# EAGLE design mapleCUx_large_400-003 (EAGLE 9.3.0)
MAPLE-CUx Large Version
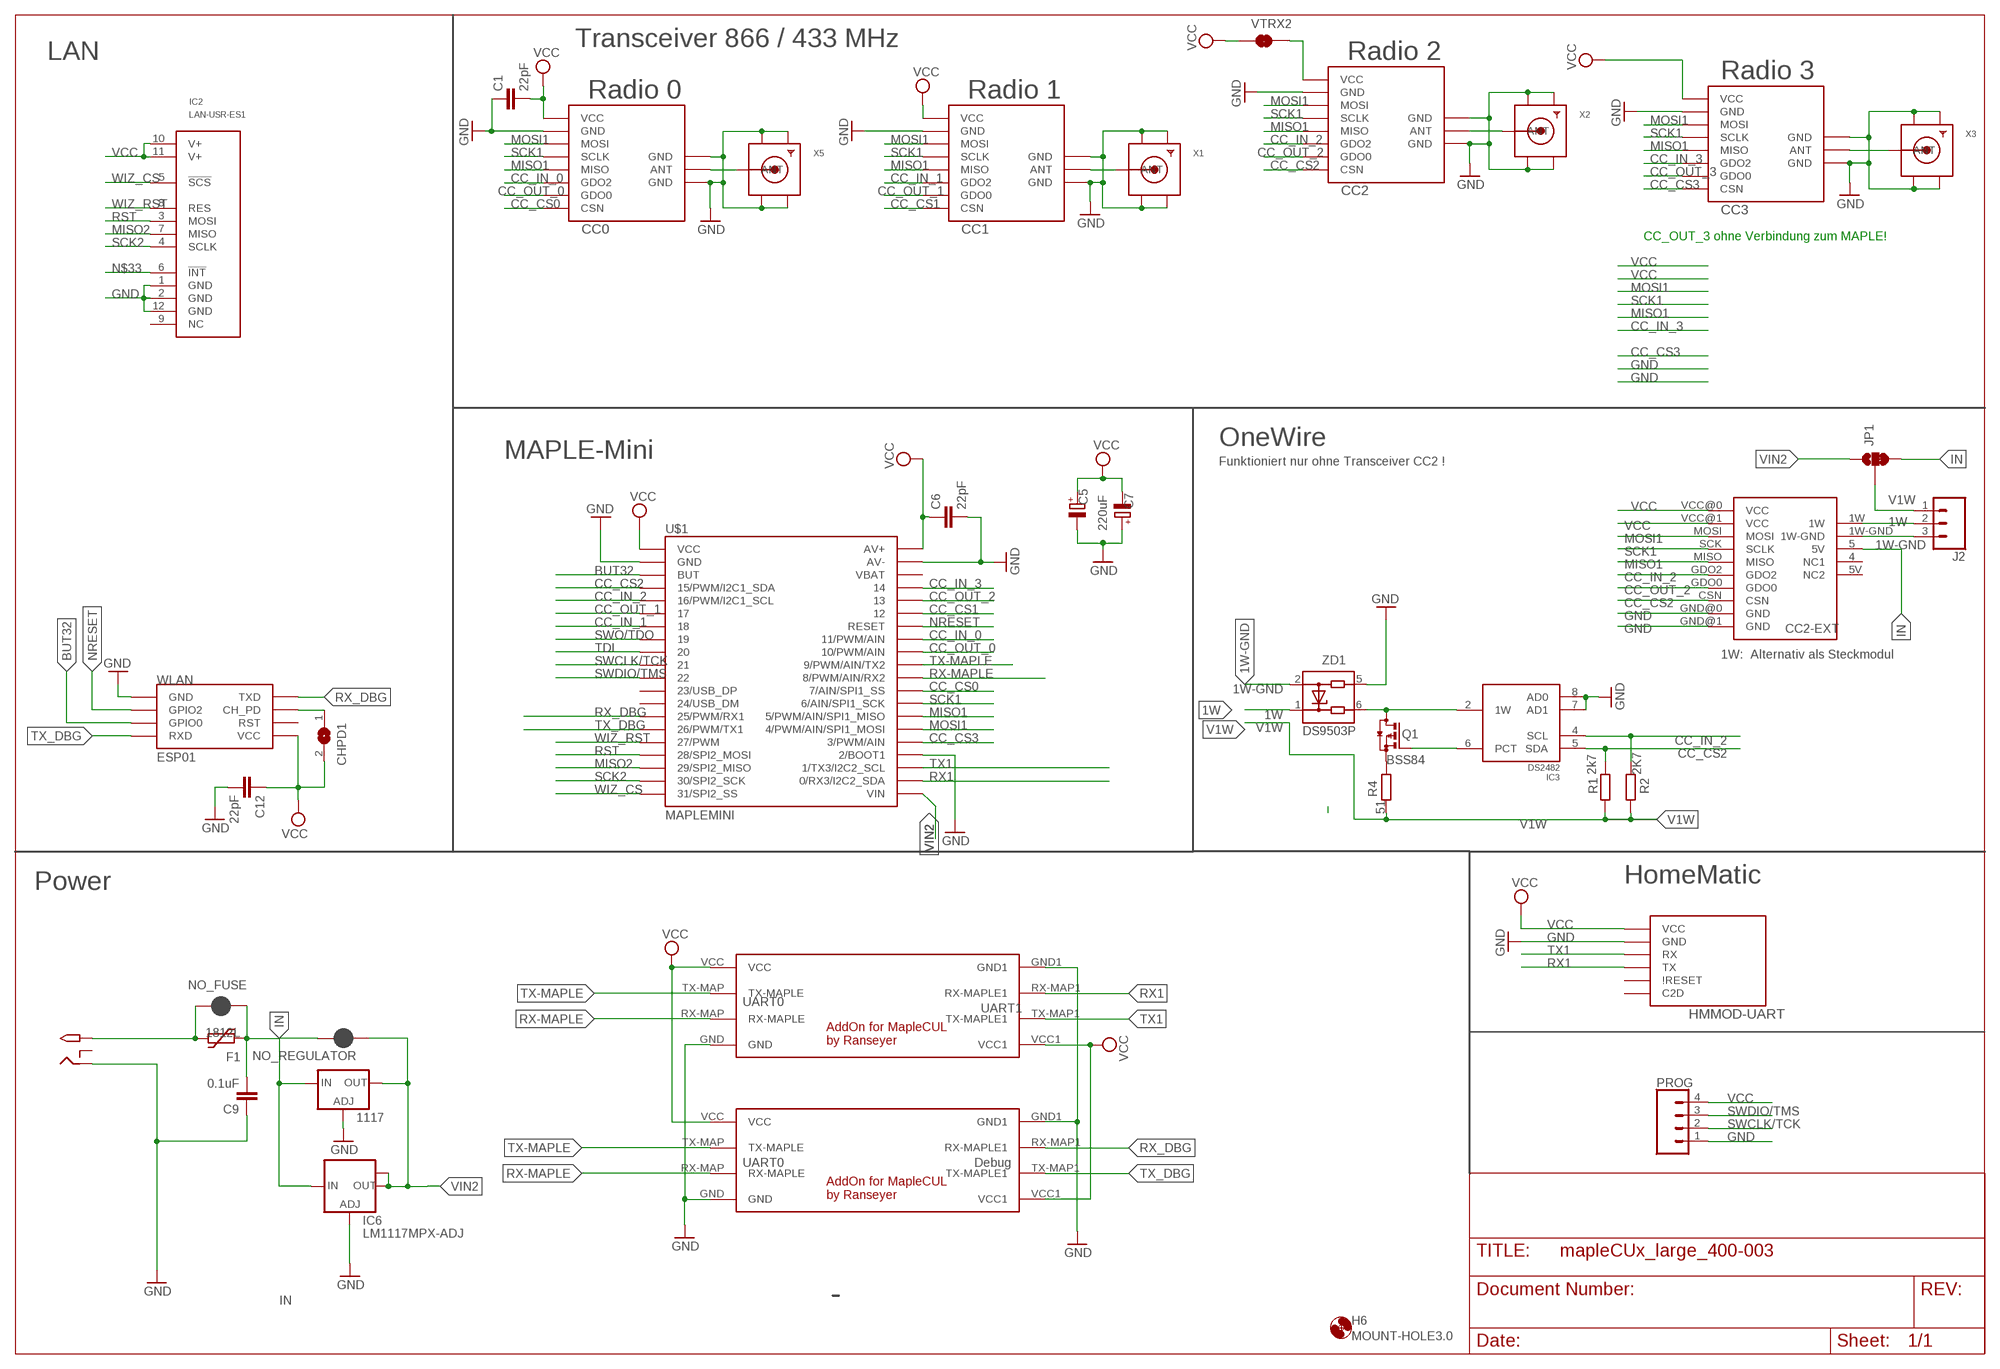
[diagram p0: schematic, sheet 1]

## Parts
1117  LD117ADT50TR  [DPACK]
C1  22pF  C-EUC0805  [C0805]
C5  220uF  CPOL-EUE5-8.5  [E5-8,5]
C6  22pF  C-EUC0805  [C0805]
C7  CPOL-EUSMCE  [SMC_E]
C9  0.1uF  C-EUC1206  [C1206]
C12  22pF  C-EUC0805  [C0805]
CC0  CC1101  CC1101_MODULE1SMD  [CC1101_MODULE1_SMD]
CC1  CC1101_MODULE1SMD  [CC1101_MODULE1_SMD]
CC2  CC1101_MODULE1SMD  [CC1101_MODULE1_SMD]
CC2-EXT  ONEWIRE-MODULE  [ONEWIRE_CC1101_MODULE3_DIL]
CC3  CC1101_MODULE1SMD  [CC1101_MODULE1_SMD]
CHPD1  SJ  [SJ]
F1  1812L  [1812L]
H6  MOUNT-HOLE3.0  [3,0]
HMMOD-UART  HM-MOD-UARTDIL  [HM-MOD-UART-DIL]
IC2  LAN-USR-ES1  [USR-ES1]
IC3  DS2482  DS2482-100S  [SO08]
IC6  LM1117MPX-ADJ  [SOT223]
J2  CONN_03LONGPADS  [1X03_LONGPADS]
JP1  JUMPER-SMT_3_1-NC_TRACE_SILK  [SMT-JUMPER_3_1-NC_TRACE_SILK]
NO_FUSE  JUMPER-SMT_2_NC_PASTE_NO-SILK  [SMT-JUMPER_2_NC_PASTE_NO-SILK]
NO_REGULATOR  JUMPER-SMT_2_NC_PASTE_NO-SILK  [SMT-JUMPER_2_NC_PASTE_NO-SILK]
PROG  CONN_04LOCK  [1X04_LOCK]
Q1  BSS84  [SOT23]
R1  2k7  R-EU_R0805  [R0805]
R2  2K7  R-EU_R0805  [R0805]
R4  51  R-EU_R0805  [R0805]
U$1  MAPLEMINI  [20-DIP]
U$2  2.1MMJACKTHM  [PJ-102A]
U$3  MAPLE-CUL-ADDON-V01  [MAPLE-CUL-V01]
U$4  MAPLE-CUL-ADDON-V01  [MAPLE-CUL-V01]
VTRX2  JUMPER-SMT_2_NC_TRACE_SILK  [SMT-JUMPER_2_NC_TRACE_SILK]
WLAN  ESP01  [ESP01]
X1  SMACONNECTOR_EDGE  [SMA_EDGELAUNCH]
X2  SMACONNECTOR_EDGE  [SMA_EDGELAUNCH]
X3  SMACONNECTOR_EDGE  [SMA_EDGELAUNCH]
X5  SMACONNECTOR_EDGE  [SMA_EDGELAUNCH]
ZD1  DS9503P  [TSOC6]

## Nets
1W: CC2-EXT.1W J2.2 ZD1.1
1W-GND: CC2-EXT.1W-GND J2.3 ZD1.2
ANT0: CC0.ANT X5.P(ANT)
ANT1: CC1.ANT X1.P(ANT)
ANT2: CC2.ANT X2.P(ANT)
ANT3: CC3.ANT X3.P(ANT)
BUT32: U$1.3(BUT) WLAN.GPIO0
CC_CS0: CC0.CSN U$1.29(7/AIN/SPI1_SS)
CC_CS1: CC1.CSN U$1.35
CC_CS2: CC2-EXT.CSN CC2.CSN IC3.5(SDA) R1.2 U$1.4(15/PWM/I2C1_SDA)
CC_CS3: CC3.CSN U$1.25(3/PWM/AIN)
CC_IN_0: CC0.GDO2 U$1.33(11/PWM/AIN)
CC_IN_1: CC1.GDO2 U$1.7
CC_IN_2: CC2-EXT.GDO2 CC2.GDO2 IC3.4(SCL) R2.2 U$1.5(16/PWM/I2C1_SCL)
CC_IN_3: CC3.GDO2 U$1.37
CC_OUT_0: CC0.GDO0 U$1.32(10/PWM/AIN)
CC_OUT_1: CC1.GDO0 U$1.6
CC_OUT_2: CC2-EXT.GDO0 CC2.GDO0 U$1.36
CC_OUT_3: CC3.GDO0
GND [Power]: 1117.1(ADJ) C1.1 C5.- C6.2 C7.+ C9.1 C12.2 CC0.GND@0(GND) CC0.GND@1(GND) CC0.GND@2(GND) CC1.GND@0(GND) CC1.GND@1(GND) CC1.GND@2(GND) CC2-EXT.GND@0(GND) CC2-EXT.GND@1(GND) CC2.GND@0(GND) CC2.GND@1(GND) CC2.GND@2(GND) CC3.GND@0(GND) CC3.GND@1(GND) CC3.GND@2(GND) HMMOD-UART.2(GND) IC2.1(GND) IC2.2(GND) IC2.12(GND) IC3.7(AD1) IC3.8(AD0) IC6.1(ADJ) PROG.1 U$1.2(GND) U$1.24(2/BOOT1) U$1.39(AV-) U$2.RING U$3.GND U$3.GND1 U$4.GND U$4.GND1 WLAN.GND X1.GND@1(GND4) X1.GND@2(GND3) X1.GND@3(GND2) X1.GND@4(GND1) X2.GND@1(GND4) X2.GND@2(GND3) X2.GND@3(GND2) X2.GND@4(GND1) X3.GND@1(GND4) X3.GND@2(GND3) X3.GND@3(GND2) X3.GND@4(GND1) X5.GND@1(GND4) X5.GND@2(GND3) X5.GND@3(GND2) X5.GND@4(GND1) ZD1.5
IN [Power]: 1117.3(IN) C9.2 CC2-EXT.5(5V) F1.P$1 IC6.3(IN) JP1.3 NO_FUSE.1 NO_REGULATOR.2
MISO1: CC0.MISO CC1.MISO CC2-EXT.MISO CC2.MISO CC3.MISO U$1.27(5/PWM/AIN/SPI1_MISO)
MISO2: IC2.7(MISO) U$1.18(29/SPI2_MISO)
MOSI1: CC0.MOSI CC1.MOSI CC2-EXT.MOSI CC2.MOSI CC3.MOSI U$1.26(4/PWM/AIN/SPI1_MOSI)
N$1 [Power]: CC2.VCC VTRX2.2
N$2: CHPD1.1 WLAN.CH_PD
N$33: IC2.6(!INT!)
N$47: IC3.6(PCT) Q1.1(G)
N$48: IC3.2(1W) Q1.3(D) ZD1.6
N$52: Q1.2(S) R4.1
NRESET: U$1.34(RESET) WLAN.GPIO2
RST: IC2.3(MOSI) U$1.17(28/SPI2_MOSI)
RX1: HMMOD-UART.5(TX) U$1.22(0/RX3/I2C2_SDA) U$3.RX-MAP1(RX-MAPLE1)
RX-MAPLE: U$1.30(8/PWM/AIN/RX2) U$3.RX-MAP(RX-MAPLE) U$4.RX-MAP(RX-MAPLE)
RX_DBG: U$1.14(25/PWM/RX1) U$4.RX-MAP1(RX-MAPLE1) WLAN.TX(TXD)
SCK1: CC0.SCLK CC1.SCLK CC2-EXT.SCK(SCLK) CC2.SCLK CC3.SCLK U$1.28(6/AIN/SPI1_SCK)
SCK2: IC2.4(SCLK) U$1.19(30/SPI2_SCK)
SWCLK/TCK: PROG.2 U$1.10
SWDIO/TMS: PROG.3 U$1.11
SWO/TDO: U$1.8
TDI: U$1.9
TX1: HMMOD-UART.6(RX) U$1.23(1/TX3/I2C2_SCL) U$3.TX-MAP1(TX-MAPLE1)
TX-MAPLE: U$1.31(9/PWM/AIN/TX2) U$3.TX-MAP(TX-MAPLE) U$4.TX-MAP(TX-MAPLE)
TX_DBG: U$1.15(26/PWM/TX1) U$4.TX-MAP1(TX-MAPLE1) WLAN.RX(RXD)
V1W [Power]: J2.1 JP1.2 R1.1 R2.1 R4.2
VCC [Power]: C1.2 C5.+ C6.1 C7.- C12.1 CC0.VCC CC1.VCC CC2-EXT.VCC@0(VCC) CC2-EXT.VCC@1(VCC) CC3.VCC CHPD1.2 HMMOD-UART.1(VCC) IC2.10(V+) IC2.11(V+) PROG.4 U$1.1(VCC) U$1.40(AV+) U$3.VCC U$3.VCC1 U$4.VCC U$4.VCC1 VTRX2.1 WLAN.VCC
VIN [Power]: F1.P$2 NO_FUSE.2 U$2.TIP
VIN2 [Power]: 1117.4(OUT) IC6.2(OUT) IC6.TAB(OUT1) JP1.1 NO_REGULATOR.1 U$1.21(VIN)
WIZ_CS: IC2.5(!SCS!) U$1.20(31/SPI2_SS)
WIZ_RST: IC2.8(RES) U$1.16(27/PWM)
Unconnected: CC2-EXT.4(NC1) CC2-EXT.5V(NC2) HMMOD-UART.3(C2D) HMMOD-UART.4(\!RESET) IC2.9(NC) U$1.12(23/USB_DP) U$1.13(24/USB_DM) U$1.38(VBAT) U$2.RING_SW WLAN.RST

## Notes on the sheet
- Transceiver 866 / 433 MHz
- LAN | Radio 2
- Radio 3
- Radio 0 | Radio 1
- CC_OUT_3 ohne Verbindung zum MAPLE!
- OneWire
- MAPLE-Mini
- Funktioniert nur ohne Transceiver CC2 !
- 1W:  Alternativ als Steckmodul
- Power | HomeMatic
- UART0
- UART1
- UART0 | Debug

## Power pins joined to a net without a drawn wire
GND: IC3.3(GND)
V1W: IC3.1(VDD)

## Library data of the parts
1117 = v-reg:LD117A?*: Low drop fixed and adjustable positive voltage regulators 1 A Source: http://www.st.com/stonline/products/literature/ds/7194/ld1117axx.pdf
C1 C6 C9 C12 = rcl:C-EU: CAPACITOR, European symbol
C5 = rcl:CPOL-EU: POLARIZED CAPACITOR, European symbol
C7 = rcl:CPOL-EU: POLARIZED CAPACITOR, European symbol; SPICEPREFIX: C
CC0 CC1-CC3 = wireless:CC1101_MODULE1: CC1101 wireless module for 433/868 MHz (sold from Aliexpress). DIL version for mounting with pin header (and SMD soldering) and SMD only variant available.
CC2-EXT = CC1101:ONEWIRE-MODULE
CHPD1 = jumper:SJ: SMD solder JUMPER
F1 = ptc-littlefuse:1812L
H6 = holes:MOUNT-HOLE: MOUNTING HOLE with drill center marker
HMMOD-UART = wireless:HM-MOD-UART: eQ3 HM-MOD-UART-AW-SH2 wireless module for 868 MHz. DIL version for mounting with pin header (antenna upwards) and SMD variant available (antenna downwards).
IC2 = Martin-Communication:LAN-USR-ES1
IC3 = 1wire:DS2482-100: I2C to 1-Wire Host Adapter/Line Driver This device is a onewire host and I2C interface in one chip. It provides the complete DC/AC requirements for onewire communication, including overdrive speed mode, but, unlike the DS2480B chip, no 12V EPROM programming. Notes: For overdrive speed and 5V EEPROM programming, an external active pullup circuit must be connected to the 1W, VDD and PCT pin. See the datasheet for details. The lower two I2C adress bits of the chip can be selected by external pins, so up to 4 chips may be connected to the same I2C bus. Author: Orginal device and description from Giovanni Varasano <giovanni.varasano@fastwebnet.it> Improved by Jan Kandziora <jjj@gmx.de>
IC6 = lm1117:LM1117MPX-ADJ
J2 = SparkFun-Connectors:CONN_03: Multi connection point. Often used as Generic Header-pin footprint for 0.1 inch spaced/style header connections On any of the 0.1 inch spaced packages, you can populate with these: Break Away Headers - Straight <https://www.sparkfun.com/products/116> (PRT-00116) Break Away Male Headers - Right Angle <https://www.sparkfun.com/products/553> (PRT-00553) Female Headers <https://www.sparkfun.com/products/115> (PRT-00115) Break Away Headers - Machine Pin <https://www.sparkfun.com/products/117> (PRT-00117) Break Away Female Headers - Swiss Machine Pin <https://www.sparkfun.com/products/743> (PRT-00743) Stackable Header - 3 Pin (Female, 0.1") <https://www.sparkfun.com/products/13875> (PRT-13875) For SCREWTERMINALS and SPRING TERMINALS visit here: Screw Terimnals on SparkFun.com <https://www.sparkfun.com/search/results?term=Screw+Terminals> (5mm/3.5mm/2.54mm spacing) This device is also useful as a general connection point to wire up your design to another part of your project. Our various solder wires solder well into these plated through hole pads. Hook-Up Wire - Assortment (Stranded, 22 AWG) <https://www.sparkfun.com/products/11375> (PRT-11375) Hook-Up Wire - Assortment (Solid Core, 22 AWG) <https://www.sparkfun.com/products/11367> (PRT-11367) View the entire wire category on our website here <https://www.sparkfun.com/categories/141> Special notes: Molex polarized connector foot print use with SKU : PRT-08232 with associated crimp pins and housings.
JP1 = SparkFun-Jumpers:JUMPER-SMT_3_1-NC_TRACE: Normally closed trace jumper (1 of 2 connections) This jumper has a trace between two pads so it's normally closed (NC). The other connection is normally open (NO). Use a razor knife to open the connection. For best results follow the IPC guidelines for cutting traces: Cutout at least 0.063 mm (0.005 in). Remove all loose material to clean up the cut area. Seal the cut with an approved epoxy. Reapply solder to reclose the connection, or to close the NO connection.
NO_FUSE NO_REGULATOR = SparkFun-Jumpers:JUMPER-SMT_2_NC_PASTE: Normally closed solder jumper This jumper has an aperture in the stencil to allow solder paste to bridge the split in the wire so it's normally closed (NC). Wick off the solder to open the connection. Reapply solder to reclose the connection.
PROG = SparkFun-Connectors:CONN_04: Multi connection point. Often used as Generic Header-pin footprint for 0.1 inch spaced/style header connections On any of the 0.1 inch spaced packages, you can populate with these: Break Away Headers - Straight <https://www.sparkfun.com/products/116> (PRT-00116) Break Away Male Headers - Right Angle <https://www.sparkfun.com/products/553> (PRT-00553) Female Headers <https://www.sparkfun.com/products/115> (PRT-00115) Break Away Headers - Machine Pin <https://www.sparkfun.com/products/117> (PRT-00117) Break Away Female Headers - Swiss Machine Pin <https://www.sparkfun.com/products/743> (PRT-00743) For SCREWTERMINALS and SPRING TERMINALS visit here: Screw Terimnals on SparkFun.com <https://www.sparkfun.com/search/results?term=Screw+Terminals> (5mm/3.5mm/2.54mm spacing) This device is also useful as a general connection point to wire up your design to another part of your project. Our various solder wires solder well into these plated through hole pads. Hook-Up Wire - Assortment (Stranded, 22 AWG) <https://www.sparkfun.com/products/11375> (PRT-11375) Hook-Up Wire - Assortment (Solid Core, 22 AWG) <https://www.sparkfun.com/products/11367> (PRT-11367) View the entire wire category on our website here <https://www.sparkfun.com/categories/141> Special notes: Molex polarized connector foot print use with SKU : PRT-08231 with associated crimp pins and housings. 1MM SMD Version SKU: PRT-10208; PROD_ID: CONN-09696
Q1 = transistor-small-signal:BSS84: P-CHANNEL MOS FET
R1 R2 R4 = rcl:R-EU_: RESISTOR, European symbol
U$1 = maplemini-small:MAPLEMINI
U$2 = adafruit:2.1MMJACK: 2.1mm x 5.5mm THM DC jack with internal switch. Digikey part #PJ-102A, 4UCON part #05537 2.1mm x 5.5mm SMT DC jack with internal switch. Digikey part #PJ-002A-SMT, 4UCON part #03267 By microbuilder.eu & adafruit.com
U$3 U$4 = Martin-Communication-V4:MAPLE-CUL-ADDON-V01: AddOn for MAPLE-CUL V4.x
VTRX2 = SparkFun-Jumpers:JUMPER-SMT_2_NC_TRACE: Normally closed trace jumper This jumper has a trace between two pads so it's normally closed (NC). Use a razor knife to open the connection. For best results follow the IPC guidelines for cutting traces: Cutout at least 0.063 mm (0.005 in). Remove all loose material to clean up the cut area. Seal the cut with an approved epoxy. Reapply solder to reclose the connection.
WLAN = esp8266modules:ESP01: ESP8266 Wifi module 01
X1-X3 X5 = adafruit:SMACONNECTOR: SMA Connector 90° DIP SMA Connector, 50 Ohm (4UConnector: 07259)
ZD1 = 1wire:DS9503: ESD Protection Diode with Resistors This ESD protection diode is designed especially for onewire host interfaces. Unlike the DS9502, it has two additional 5Ohm resitors in the 1W and GND line. Pin 5 and 6 have to be connected to the host side, pin 1 und 2 to the network side. The 1W line is through pin 1 and 6, the GND line is through pin 2 and 5. Author: Jan Kandziora <jjj@gmx.de>

## Net classes
0 default: width 0.305 mm
1 Power: width 0.61 mm

## Board
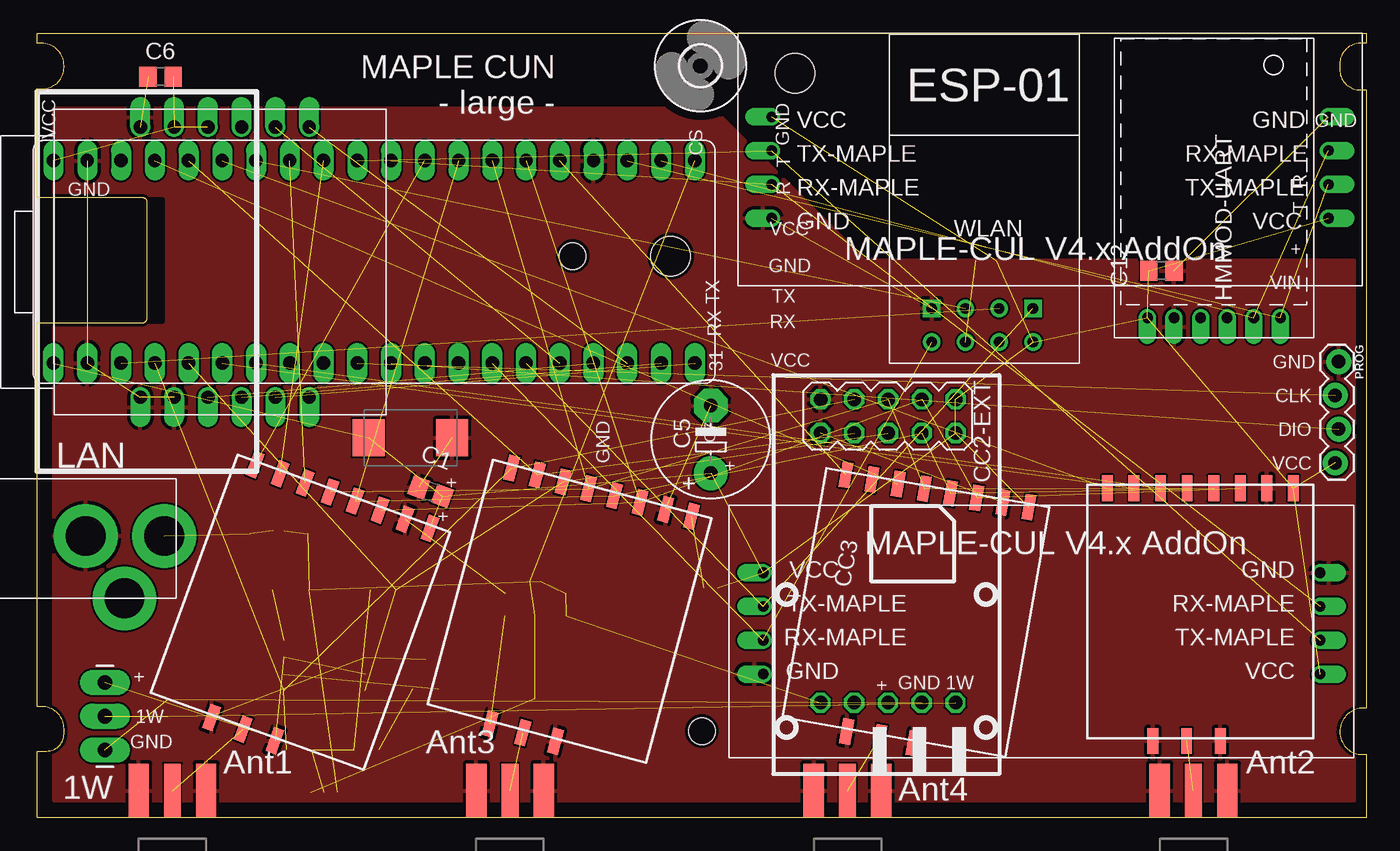
[diagram p1: board, top side]
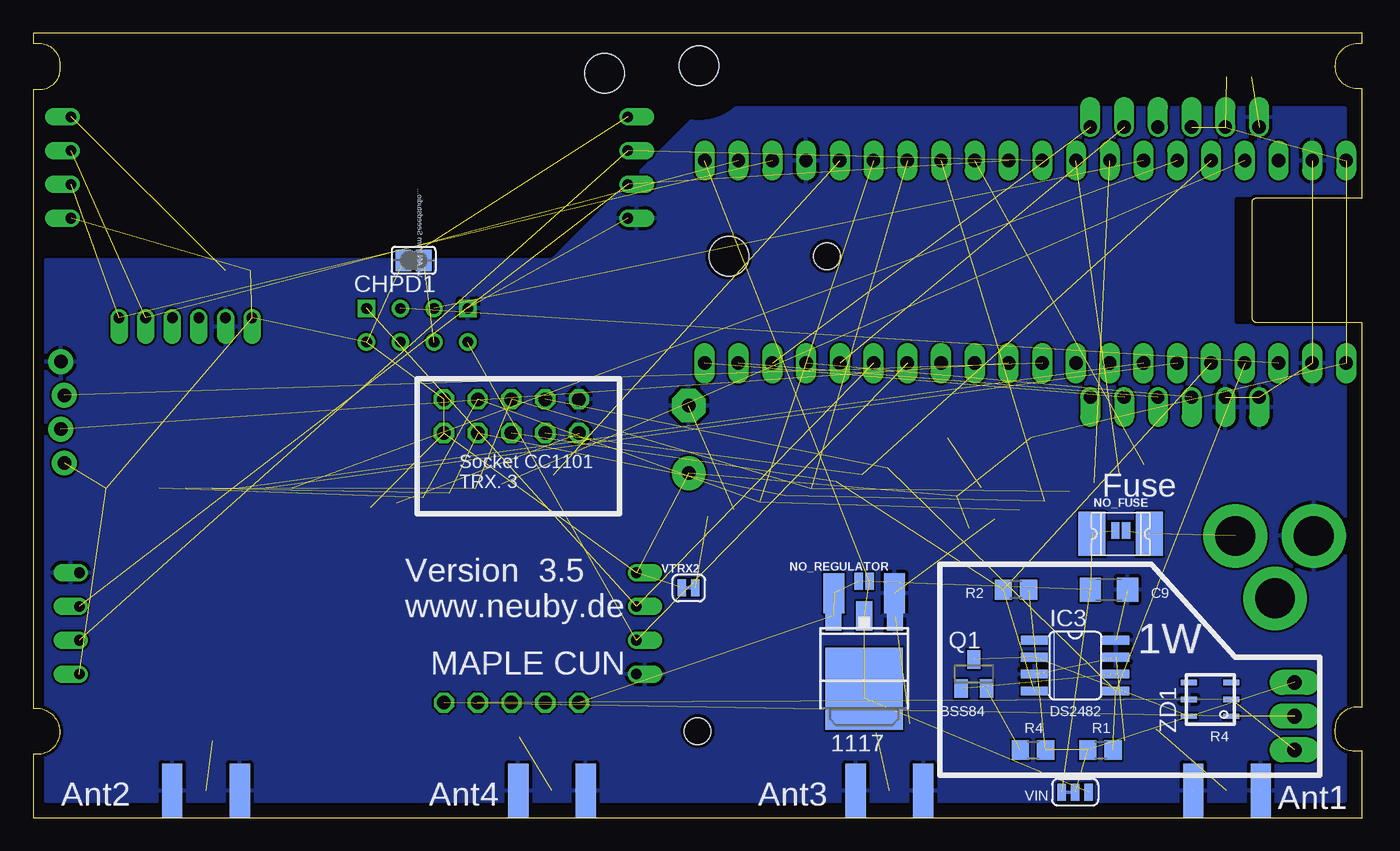
[diagram p2: board, bottom side, seen from below]

Size 100 x 59 mm. Coordinates in mm from the lower left corner, seen from the top.
Outline: 0,0 0,5 0.71,5 arc90 2,6.29 2,6.67 arc90 0.32,8.35 0,8.35 0,37.21 7.89,37.21 arc90 8.26,37.58 8.26,46.32 arc90 7.97,46.61 0,46.61 0,54.83 0.39,54.83 arc90 2,56.44 2,56.57 arc90 0.33,58.24 0,58.24 0,59 100,59 100,58.24 99.54,58.24 arc90 98,56.7 98,56.41 arc90 99.41,54.75 100,54.75 100,8.24 99.8,8.24 arc90 98,6.44 arc90 99.69,4.75 100,4.75 100,0 0,0
Copper layers (1*16): Top 0.035mm / dielectric 1.5mm / Bottom 0.035mm
Design rules "SeeedStudio_2layer_DRU_no_angle_20140221": minimum track width 6mil, minimum drill 12mil, track to track 6mil, track to pad 6mil, pad to pad 6mil, via to via 6mil, smd to smd 0mil, copper to edge 10mil, drill to drill 10mil, minimum pad ring 10mil, minimum via ring 6mil, stop-mask expansion 2mil, vias tented up to drill 100mil, thermal gap 10mil
Holes 2 mm at 50,6.5 40.28,42.23
Holes 3 mm at 47.65,42.23 57,56
tRestrict: area 0,37.3 to 9.4,46.5
bRestrict: area 0,37.3 to 9.4,46.5

### Footprints (pad centres in the part's own frame; a part is rotated, then mirrored left to right if it is on the bottom)
DPACK = smd 1.6 x 3: 1 -2.28,-4.8; 3 2.28,-4.8 | smd 5.8 x 6.2: 4 0,2.38
C0805 = smd 1.3 x 1.5: 1 -0.95,0; 2 0.95,0
E5-8,5 = drill 1.016 pad 2.54: + -2.54,0 | drill 1.016 pad 2.54 octagon: - 2.54,0
SMC_E = smd 2.4 x 2.8: + -3.15,0; - 3.15,0
C1206 = smd 1.6 x 1.8: 1 -1.4,0; 2 1.4,0
CC1101_MODULE1_SMD = smd 1.93 x 0.813: ANT 19,5.96; CSN 0,0; GDO0 0,2; GDO2 0,4; GND@0 0,12; GND@1 19,8.5; GND@2 19,3.42; MISO 0,6; MOSI 0,10; SCLK 0,8; VCC 0,14
ONEWIRE_CC1101_MODULE3_DIL = drill 1.016 octagon: 1W 24.638,13.716; 1W-GND 24.638,11.176; 4 24.638,6.096; 5 24.638,3.556; 5V 24.638,8.636; CSN 1.81,6.1; GDO0 4.35,6.1; GDO2 4.35,8.64; GND@0 1.81,3.56; GND@1 4.35,3.56; MISO 1.81,8.64; MOSI 1.81,11.18; SCK 4.35,11.18; VCC@0 1.81,13.72; VCC@1 4.35,13.72
SJ = smd 1.168 x 1.6: 1 -0.762,0; 2 0.762,0
1812L = smd 2.03 x 3.3: P$1 -2.16,0; P$2 2.16,0
3,0 = hole 3: 0,0
HM-MOD-UART-DIL = drill 0.8 offset: 1 0,12; 2 0,10; 3 0,8; 4 0,6; 5 0,4; 6 0,2
USR-ES1 = drill 1 pad 1.35 offset: 1 -10.16,5.715; 2 -10.16,3.175; 3 -10.16,0.635; 4 -10.16,-1.905; 5 -10.16,-4.445; 6 -10.16,-6.985; 7 10.16,-6.985; 8 10.16,-4.445; 9 10.16,-1.905; 10 10.16,0.635; 11 10.16,3.175; 12 10.16,5.715
SO08 = smd 0.66 x 2.032: 1 -1.905,-3.073; 2 -0.635,-3.073; 3 0.635,-3.073; 4 1.905,-3.073; 5 1.905,3.073; 6 0.635,3.073; 7 -0.635,3.073; 8 -1.905,3.073
SOT223 = smd 1.219 x 2.235: 1 -2.311,-3.099; 2 0,-3.099; 3 2.311,-3.099 | smd 3.6 x 2.2: TAB 0,3.099
1X03_LONGPADS = drill 1.118 pad 1.88 long: 1 0,0; 2 2.54,0; 3 5.08,0
SMT-JUMPER_3_1-NC_TRACE_SILK = smd 0.635 x 1.27: 1 -1.016,0; 2 0,0; 3 1.016,0
SMT-JUMPER_2_NC_PASTE_NO-SILK = smd 0.635 x 1.27: 1 -0.406,0; 2 0.406,0
1X04_LOCK = drill 1.016 pad 1.88: 1 0,0.127; 2 2.54,-0.127; 3 5.08,0.127; 4 7.62,-0.127
SOT23 = smd 1 x 1.4: 1 -0.95,-1.1; 2 0.95,-1.1; 3 0,1.1
R0805 = smd 1.3 x 1.5: 1 -0.95,0; 2 0.95,0
20-DIP = drill 1.016 pad 1.27 long: 1 -24.13,-7.62; 2 -21.59,-7.62; 3 -19.05,-7.62; 4 -16.51,-7.62; 5 -13.97,-7.62; 6 -11.43,-7.62; 7 -8.89,-7.62; 8 -6.35,-7.62; 9 -3.81,-7.62; 10 -1.27,-7.62; 11 1.27,-7.62; 12 3.81,-7.62; 13 6.35,-7.62; 14 8.89,-7.62; 15 11.43,-7.62; 16 13.97,-7.62; 17 16.51,-7.62; 18 19.05,-7.62; 19 21.59,-7.62; 20 24.13,-7.62 | drill 1 pad 1.27 long: 21 24.13,7.62; 22 21.59,7.62; 23 19.05,7.62; 24 16.51,7.62; 25 13.97,7.62; 26 11.43,7.62; 27 8.89,7.62; 28 6.35,7.62; 29 3.81,7.62; 30 1.27,7.62; 31 -1.27,7.62; 32 -3.81,7.62; 33 -6.35,7.62; 34 -8.89,7.62; 35 -11.43,7.62; 36 -13.97,7.62; 37 -16.51,7.62; 38 -19.05,7.62; 39 -21.59,7.62; 40 -24.13,7.62
PJ-102A = drill 3 pad 4.8: RING 0.1,-3.39; RING_SW -4.6,-6.29; TIP 0.1,-9.29
MAPLE-CUL-V01 = drill 0.8 offset: GND 2.54,5.08; GND1 44.45,12.7; RX-MAP 2.54,7.62; RX-MAP1 44.45,10.16; TX-MAP 2.54,10.16; TX-MAP1 44.45,7.62; VCC 2.54,12.7; VCC1 44.45,5.08
SMT-JUMPER_2_NC_TRACE_SILK = smd 0.635 x 1.27: 1 -0.508,0; 2 0.508,0
ESP01 = drill 0.8: CH_PD -1.285,-8.178; GPIO0 1.255,-5.638; GPIO2 -1.285,-5.638; RST 1.255,-8.178; TX -3.825,-8.178; VCC 3.795,-8.178 | drill 0.8 square: GND -3.825,-5.638; RX 3.795,-5.638
SMA_EDGELAUNCH = smd 4.064 x 1.524: GND@1 2.032,-2.54; GND@2 2.032,2.54 | smd 4.064 x 1.524 bottom: GND@3 2.032,2.54; GND@4 2.032,-2.54 | smd 4.064 x 1.27: P 2.032,0
TSOC6 = smd 0.406 x 1.219: 1 -1.27,-1.6; 2 0,-1.6; 3 1.27,-1.6; 4 1.27,1.6; 5 0,1.6; 6 -1.27,1.6

### Placement (x,y rotation side)
1117  37.47,12.06 180 bottom
C1  29.59,24.51 340 top
C5  50.67,28.45 90 top
C6  9.27,55.74 180 top
C7  28.07,28.57 180 top
C9  19.05,17.14 180 bottom
C12  84.58,41.15 0 top
CC0  16.38,26.54 250 top
CC1  80.52,24.77 270 top
CC2  35.69,26.29 255 top
CC2-EXT  55.37,33.27 270 top
CC3  60.83,25.78 260 top
CHPD1  71.37,41.91 180 bottom
F1  18.16,21.34 0 bottom
H6  49.89,56.55 0 top
HMMOD-UART  95.54,37.59 90 top
IC2  13.46,41.78 90 top
IC3  21.59,11.43 270 bottom
IC6  37.47,12.06 180 bottom
J2  5.08,10.16 270 top
JP1  21.59,1.91 180 bottom
NO_FUSE  18.16,21.59 0 bottom
NO_REGULATOR  37.47,17.78 180 bottom
PROG  97.79,34.29 270 top
Q1  29.21,10.79 0 bottom
R1  19.68,5.08 0 bottom
R2  26.04,17.14 180 bottom
R4  24.77,5.08 0 bottom
U$1  25.34,41.8 0 top
U$2  0.25,21.08 90 top
U$3  52.7,40.01 0 top
U$4  99.06,23.5 180 top
VTRX2  50.67,17.27 0 bottom
WLAN  71.12,43.94 0 top
X1  87,0 90 top
X2  35.56,0 90 top
X3  60.96,0 90 top
X5  10.16,0 90 top
ZD1  11.43,8.89 90 bottom

### Tracks (layer width: path | path; a pad name or v marks a point on that pad's centre or on a via)
1W  (2 unrouted)
1W-GND  (2 unrouted)
ANT0  (1 unrouted)
ANT1  (1 unrouted)
ANT2  (1 unrouted)
ANT3  (1 unrouted)
BUT32  (1 unrouted)
CC_CS0  (1 unrouted)
CC_CS1  (1 unrouted)
CC_CS2  (4 unrouted)
CC_CS3  (1 unrouted)
CC_IN_0  (1 unrouted)
CC_IN_1  (1 unrouted)
CC_IN_2  (4 unrouted)
CC_IN_3  (1 unrouted)
CC_OUT_0  (1 unrouted)
CC_OUT_1  (1 unrouted)
CC_OUT_2  (2 unrouted)
GND  (16 unrouted)
  pour Top: 1.27,1.27 1.27,53.34 50.8,53.34 62.23,41.91 99.06,41.91 99.06,1.27
  pour Bottom: 1.27,1.27 1.27,53.34 49.53,53.34 60.96,41.91 99.06,41.91 99.06,1.27
IN  (7 unrouted)
MISO1  (5 unrouted)
MISO2  (1 unrouted)
MOSI1  (5 unrouted)
N$1  (1 unrouted)
N$2  (1 unrouted)
N$47  (1 unrouted)
N$48  (2 unrouted)
N$52  (1 unrouted)
NRESET  (1 unrouted)
RST  (1 unrouted)
RX1  (2 unrouted)
RX-MAPLE  (2 unrouted)
RX_DBG  (2 unrouted)
SCK1  (5 unrouted)
SCK2  (1 unrouted)
SWCLK/TCK  (1 unrouted)
SWDIO/TMS  (1 unrouted)
TX1  (2 unrouted)
TX-MAPLE  (2 unrouted)
TX_DBG  (2 unrouted)
V1W  (5 unrouted)
VCC  (22 unrouted)
VIN  (2 unrouted)
VIN2  (5 unrouted)
WIZ_CS  (1 unrouted)
WIZ_RST  (1 unrouted)

### Text on the board
tNames: MAPLE CUN / - large - | GND | CS | VCC | GND | T | GND | R | R | VCC | T | + | GND | VIN | TX | TX | RX | RX | 31 | VCC | GND | CLK | GND | DIO | LAN | C7 | VCC | + | + | + | GND | 1W | + | + | 1W | GND | Ant3 | Ant1 | Ant2 | 1W | Ant4
bNames: WLAN from Seeedstudio... | Socket CC1101 / TRX. 3 | Fuse | C9 | R2 | 1W | Version 3.5 / www.neuby.de | MAPLE CUN | DS2482 | BSS84 | R4 | R1 | R4 | Ant1 | VIN | Ant3 | Ant4 | Ant2 | R1